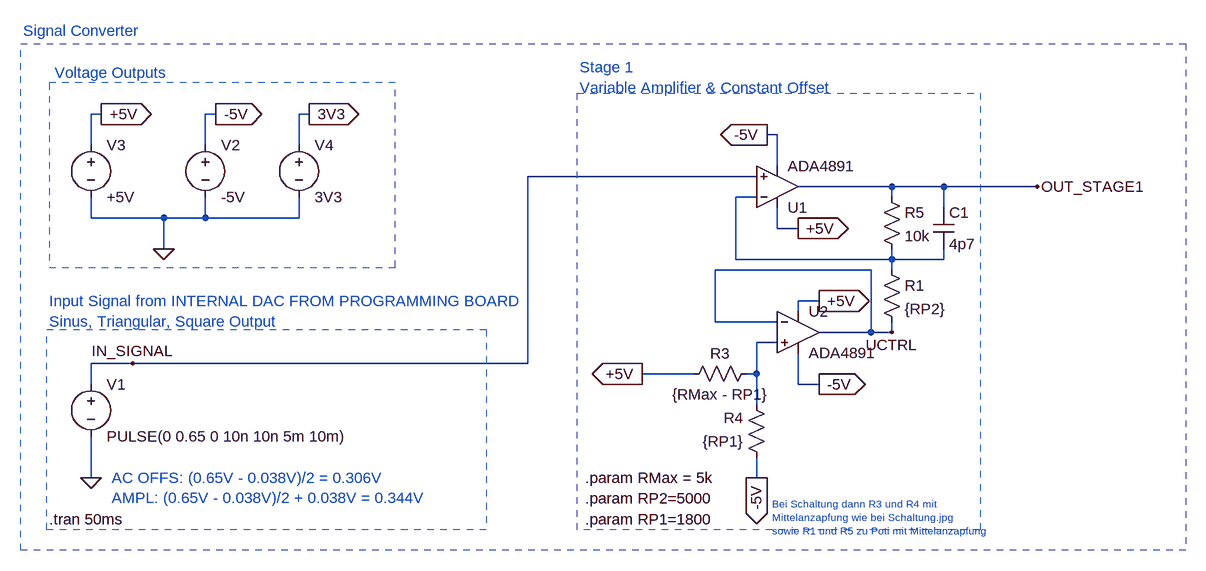
[diagram p0: schematic signal_converter_variable_potentiometer.asc]
signal_converter_variable_potentiometer.asc, the LTspice schematic file:
Version 4
SHEET 1 2372 984
WIRE 32 -320 16 -320
WIRE 208 -320 192 -320
WIRE 352 -320 336 -320
WIRE 1072 -288 1056 -288
WIRE 16 -272 16 -320
WIRE 192 -272 192 -320
WIRE 336 -272 336 -320
WIRE 1072 -240 1072 -288
WIRE 1040 -224 688 -224
WIRE 1248 -208 1104 -208
WIRE 1328 -208 1248 -208
WIRE 1472 -208 1328 -208
WIRE 1040 -192 1008 -192
WIRE 1248 -192 1248 -208
WIRE 1328 -176 1328 -208
WIRE 16 -160 16 -192
WIRE 128 -160 16 -160
WIRE 192 -160 192 -192
WIRE 192 -160 128 -160
WIRE 336 -160 336 -192
WIRE 336 -160 192 -160
WIRE 1072 -144 1072 -176
WIRE 1104 -144 1072 -144
WIRE 128 -112 128 -160
WIRE 1008 -96 1008 -192
WIRE 1248 -96 1248 -112
WIRE 1248 -96 1008 -96
WIRE 1328 -96 1328 -112
WIRE 1328 -96 1248 -96
WIRE 1216 -80 976 -80
WIRE 1248 -80 1248 -96
WIRE 1136 -32 1104 -32
WIRE 1104 -16 1104 -32
WIRE 976 0 976 -80
WIRE 1072 0 976 0
WIRE 1216 16 1216 -80
WIRE 1216 16 1136 16
WIRE 1248 16 1248 0
WIRE 1248 16 1216 16
WIRE 1072 32 1040 32
WIRE 80 64 16 64
WIRE 688 64 688 -224
WIRE 688 64 80 64
WIRE 944 80 864 80
WIRE 1040 80 1040 32
WIRE 1040 80 1024 80
WIRE 16 96 16 64
WIRE 1104 96 1104 48
WIRE 1136 96 1104 96
WIRE 1040 128 1040 80
WIRE 16 240 16 176
WIRE 1040 240 1040 208
FLAG 16 240 0
FLAG 128 -112 0
FLAG 32 -320 +5V
IOPIN 32 -320 Out
FLAG 208 -320 -5V
IOPIN 208 -320 Out
FLAG 352 -320 3V3
IOPIN 352 -320 Out
FLAG 80 64 IN_SIGNAL
FLAG 1104 -144 +5V
IOPIN 1104 -144 Out
FLAG 1056 -288 -5V
IOPIN 1056 -288 Out
FLAG 1472 -208 OUT_STAGE1
FLAG 864 80 +5V
IOPIN 864 80 Out
FLAG 1136 -32 +5V
IOPIN 1136 -32 Out
FLAG 1136 96 -5V
IOPIN 1136 96 Out
FLAG 1040 240 -5V
IOPIN 1040 240 Out
FLAG 1248 16 UCTRL
SYMBOL voltage 16 80 R0
WINDOW 123 0 0 Left 2
WINDOW 39 0 0 Left 2
SYMATTR InstName V1
SYMATTR Value PULSE(0 0.65 0 10n 10n 5m 10m)
SYMBOL voltage 192 -288 R0
WINDOW 123 0 0 Left 2
WINDOW 39 0 0 Left 2
SYMATTR InstName V2
SYMATTR Value -5V
SYMBOL voltage 16 -288 R0
WINDOW 123 0 0 Left 2
WINDOW 39 0 0 Left 2
SYMATTR InstName V3
SYMATTR Value +5V
SYMBOL voltage 336 -288 R0
WINDOW 123 0 0 Left 2
WINDOW 39 0 0 Left 2
SYMATTR InstName V4
SYMATTR Value 3V3
SYMBOL res 1232 -208 R0
SYMATTR InstName R5
SYMATTR Value 10k
SYMBOL cap 1312 -176 R0
SYMATTR InstName C1
SYMATTR Value 4p7
SYMBOL ADA4891 1072 -144 M180
SYMATTR InstName U1
SYMBOL /res 1232 -96 R0
SYMATTR InstName R1
SYMATTR Value {RP2}
SYMBOL res 1040 64 R90
WINDOW 0 0 56 VBottom 2
WINDOW 3 32 56 VTop 2
SYMATTR InstName R3
SYMATTR Value {RMax - RP1}
SYMBOL res 1056 224 R180
WINDOW 0 36 76 Left 2
WINDOW 3 36 40 Left 2
SYMATTR InstName R4
SYMATTR Value {RP1}
SYMBOL ADA4891 1104 -48 R0
SYMATTR InstName U2
TEXT -48 304 Left 2 !.tran 50ms
TEXT 48 240 Left 2 ;AC OFFS: (0.65V - 0.038V)/2 = 0.306V\nAMPL: (0.65V - 0.038V)/2 + 0.038V = 0.344V
TEXT -40 -384 Left 2 ;Voltage Outputs
TEXT -48 -32 Left 2 ;Input Signal from INTERNAL DAC FROM PROGRAMMING BOARD\nSinus, Triangular, Square Output
TEXT 768 -392 Left 2 ;Stage 1\nVariable Amplifier & Constant Offset
TEXT 776 272 Left 2 !.param RP2=5000
TEXT 776 304 Left 2 !.param RP1=1800
TEXT -88 -448 Left 2 ;Signal Converter
TEXT 1064 280 Left 1 ;Bei Schaltung dann R3 und R4 mit\nMittelanzapfung wie bei Schaltung.jpg\nsowie R1 und R5 zu Poti mit Mittelanzapfung
TEXT 776 240 Left 2 !.param RMax = 5k
RECTANGLE Normal 484 -368 -48 -84 1
RECTANGLE Normal -52 12 624 320 1
RECTANGLE Normal 764 -352 1384 320 1
RECTANGLE Normal -92 -428 1700 352 1

The netlist it stands for:
* signal_converter_variable_potentiometer.asc
V1 IN_SIGNAL 0 PULSE(0 0.65 0 10n 10n 5m 10m)
V2 -5V 0 -5V
V3 +5V 0 +5V
V4 3V3 0 3V3
R5 OUT_STAGE1 N001 10k
C1 OUT_STAGE1 N001 4p7
XU1 IN_SIGNAL N001 +5V -5V OUT_STAGE1 ADA4891-1  ; pins In+ In- V+ V- OUT
R1 N001 UCTRL {RP2}
R3 N002 +5V {RMax - RP1}
R4 -5V N002 {RP1}
XU2 N002 UCTRL +5V -5V UCTRL ADA4891-1  ; pins In+ In- V+ V- OUT
.tran 50ms
* AC OFFS: (0.65V - 0.038V)/2 = 0.306V
* AMPL: (0.65V - 0.038V)/2 + 0.038V = 0.344V
* Voltage Outputs
* Input Signal from INTERNAL DAC FROM PROGRAMMING BOARD
* Sinus, Triangular, Square Output
* Stage 1
* Variable Amplifier & Constant Offset
.param RP2=5000
.param RP1=1800
* Signal Converter
* Bei Schaltung dann R3 und R4 mit
* Mittelanzapfung wie bei Schaltung.jpg
* sowie R1 und R5 zu Poti mit Mittelanzapfung
.param RMax = 5k
.lib ADA4891-1.lib
.backanno
.end